# EAGLE design OPL3_adapter (EAGLE 5.11)
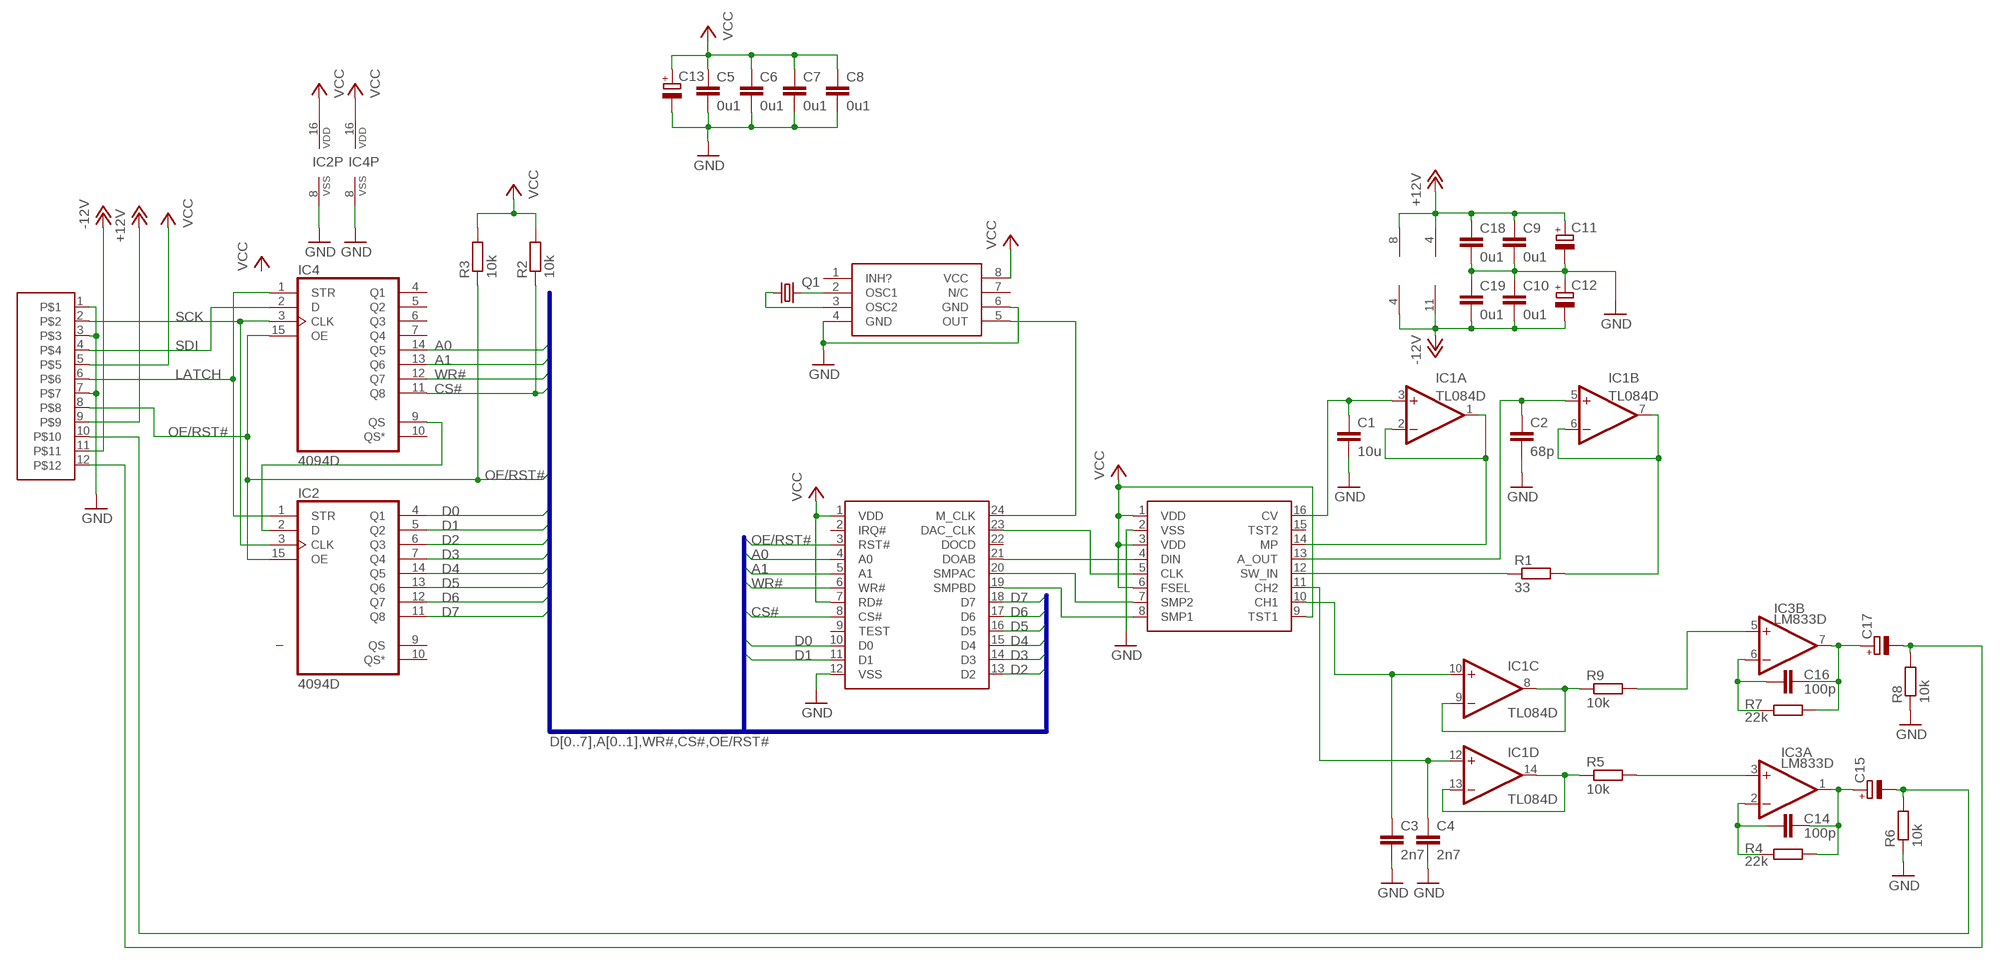
[diagram p0: schematic, sheet 1]

## Parts
C1  10u  C-EUC0805  [C0805]
C2  68p  C-EUC0603  [C0603]
C3  2n7  C-EUC0805  [C0805]
C4  2n7  C-EUC0805  [C0805]
C5  0u1  C-EUC0603  [C0603]
C6  0u1  C-EUC0603  [C0603]
C7  0u1  C-EUC0603  [C0603]
C8  0u1  C-EUC0603  [C0603]
C9  0u1  C-EUC0603  [C0603]
C10  0u1  C-EUC0603  [C0603]
C11  CPOL-EUE2.5-5  [E2,5-5]
C12  CPOL-EUE2.5-5  [E2,5-5]
C13  CPOL-EUE2.5-5  [E2,5-5]
C14  100p  C-EUC0603  [C0603]
C15  CPOL-EUE2.5-5  [E2,5-5]
C16  100p  C-EUC0603  [C0603]
C17  CPOL-EUE2.5-5  [E2,5-5]
C18  0u1  C-EUC0603  [C0603]
C19  0u1  C-EUC0603  [C0603]
IC1  TL084D  [SO14]
IC2  4094D  [SO16]
IC3  LM833D  [SO08]
IC4  4094D  [SO16]
Q1  CRYSTALHC49U-H  [HC49U-H]
R1  33  R-EU_R0603  [R0603]
R2  10k  R-EU_R0402  [R0402]
R3  10k  R-EU_R0402  [R0402]
R4  22k  R-EU_R0603  [R0603]
R5  10k  R-EU_R0603  [R0603]
R6  10k  R-EU_R0603  [R0603]
R7  22k  R-EU_R0603  [R0603]
R8  10k  R-EU_R0603  [R0603]
R9  10k  R-EU_R0603  [R0603]
U$1  YAC512  [16SOP]
U$2  YMF262  [24SOP]
U$3  SMD_PCBEDGE_HDC12  [SMD_PCB_EGGE_HDC12]
U$4  NPC_OSC_IC  [SO-08]

## Nets
+12V: C9.1 C11.+ C18.1 IC1.4(P:V+) IC3.8(P:V+) U$3.9
-12V: C10.2 C12.- C19.2 IC1.11(P:V-) IC3.4(P:V-) U$3.11
A0: IC4.14(Q5) U$2.4(A0)
A1: IC4.13(Q6) U$2.5(A1)
CS#: IC4.11(Q8) R2.1 U$2.8(CS#)
D0: IC2.4(Q1) U$2.10(D0)
D1: IC2.5(Q2) U$2.11(D1)
D2: IC2.6(Q3) U$2.13(D2)
D3: IC2.7(Q4) U$2.14(D3)
D4: IC2.14(Q5) U$2.15(D4)
D5: IC2.13(Q6) U$2.16(D5)
D6: IC2.12(Q7) U$2.17(D6)
D7: IC2.11(Q8) U$2.18(D7)
GND: C1.2 C2.2 C3.2 C4.2 C5.2 C6.2 C7.2 C8.2 C9.2 C10.1 C11.- C12.+ C13.- C18.2 C19.1 IC2.8(VSS) IC4.8(VSS) R6.1 R8.1 U$1.2(VSS) U$2.12(VSS) U$3.1 U$3.3 U$3.7 U$4.4(GND) U$4.6(GND)
LATCH: IC2.1(STR) IC4.1(STR) U$3.6
N$1: IC1.1(A:OUT) IC1.2(A:-IN) U$1.14(MP)
N$2: C1.1 IC1.3(A:+IN) U$1.16(CV)
N$3: R1.1 U$1.12(SW_IN)
N$4: C2.1 IC1.5(B:+IN) U$1.13(A_OUT)
N$5: IC1.6(B:-IN) IC1.7(B:OUT) R1.2
N$6: U$1.5(CLK) U$2.23(DAC_CLK)
N$7: U$1.4(DIN) U$2.21(DOAB)
N$8: IC2.2(D) IC4.9(QS)
N$9: U$1.8(SMP1) U$2.19(SMPBD)
N$10: C17.- R8.2 U$3.12
N$11: IC1.8(C:OUT) IC1.9(C:-IN) R9.1
N$12: C4.1 IC1.12(D:+IN) U$1.11(CH2)
N$13: C3.1 IC1.10(C:+IN) U$1.10(CH1)
N$14: U$1.7(SMP2) U$2.20(SMPAC)
N$16: U$2.24(M_CLK) U$4.5(OUT)
N$17: Q1.2 U$4.2(OSC1)
N$18: Q1.1 U$4.3(OSC2)
N$19: IC3.5(B:+IN) R9.2
N$20: IC1.13(D:-IN) IC1.14(D:OUT) R5.1
N$21: IC3.3(A:+IN) R5.2
N$22: C14.1 IC3.2(A:-IN) R4.1
N$23: C14.2 C15.+ IC3.1(A:OUT) R4.2
N$25: C15.- R6.2 U$3.10
N$27: C16.1 IC3.6(B:-IN) R7.1
N$28: C16.2 C17.+ IC3.7(B:OUT) R7.2
OE/RST#: IC2.15(OE) IC4.15(OE) R3.1 U$2.3(RST#) U$3.8
SCK: IC2.3(CLK) IC4.3(CLK) U$3.2
SDI: IC4.2(D) U$3.4
VCC: C5.1 C6.1 C7.1 C8.1 C13.+ IC2.16(VDD) IC4.16(VDD) R2.2 R3.2 U$1.1(VDD) U$1.3(VDD) U$1.6(FSEL) U$1.9(TST1) U$2.1(VDD) U$2.7(RD#) U$3.5 U$4.8(VCC)
WR#: IC4.12(Q7) U$2.6(WR#)
Unconnected: IC2.9(QS) IC2.10(QS*) IC4.4(Q1) IC4.5(Q2) IC4.6(Q3) IC4.7(Q4) IC4.10(QS*) U$1.15(TST2) U$2.2(IRQ#) U$2.9(TEST) U$2.22(DOCD) U$4.1(INH?) U$4.7(N/C)

## Buses
D[0..7],A[0..1],WR#,CS#,OE/RST#

## Library data of the parts
C1-C10 C14 C16 C18 C19 = rcl:C-EU: CAPACITOR, European symbol
C11-C13 C15 C17 = rcl:CPOL-EU: POLARIZED CAPACITOR, European symbol
IC1 = linear:TL084: OP AMP
IC2 IC4 = 40xx:4094: 8-stage SHIFT/STORE REGISTER, tri-state
IC3 = linear:LM833: OP AMP
Q1 = crystal:CRYSTAL: CRYSTAL; OC_FARNELL: 1666973; OC_NEWARK: unknown
R1-R9 = rcl:R-EU_: RESISTOR, European symbol
U$1 = OPL3:YAC512
U$2 = OPL3:YMF262
U$3 = edgeMounted_HDC:SMD_PCBEDGE_HDC12
U$4 = OSC_IC:NPC_OSC_IC

## Board
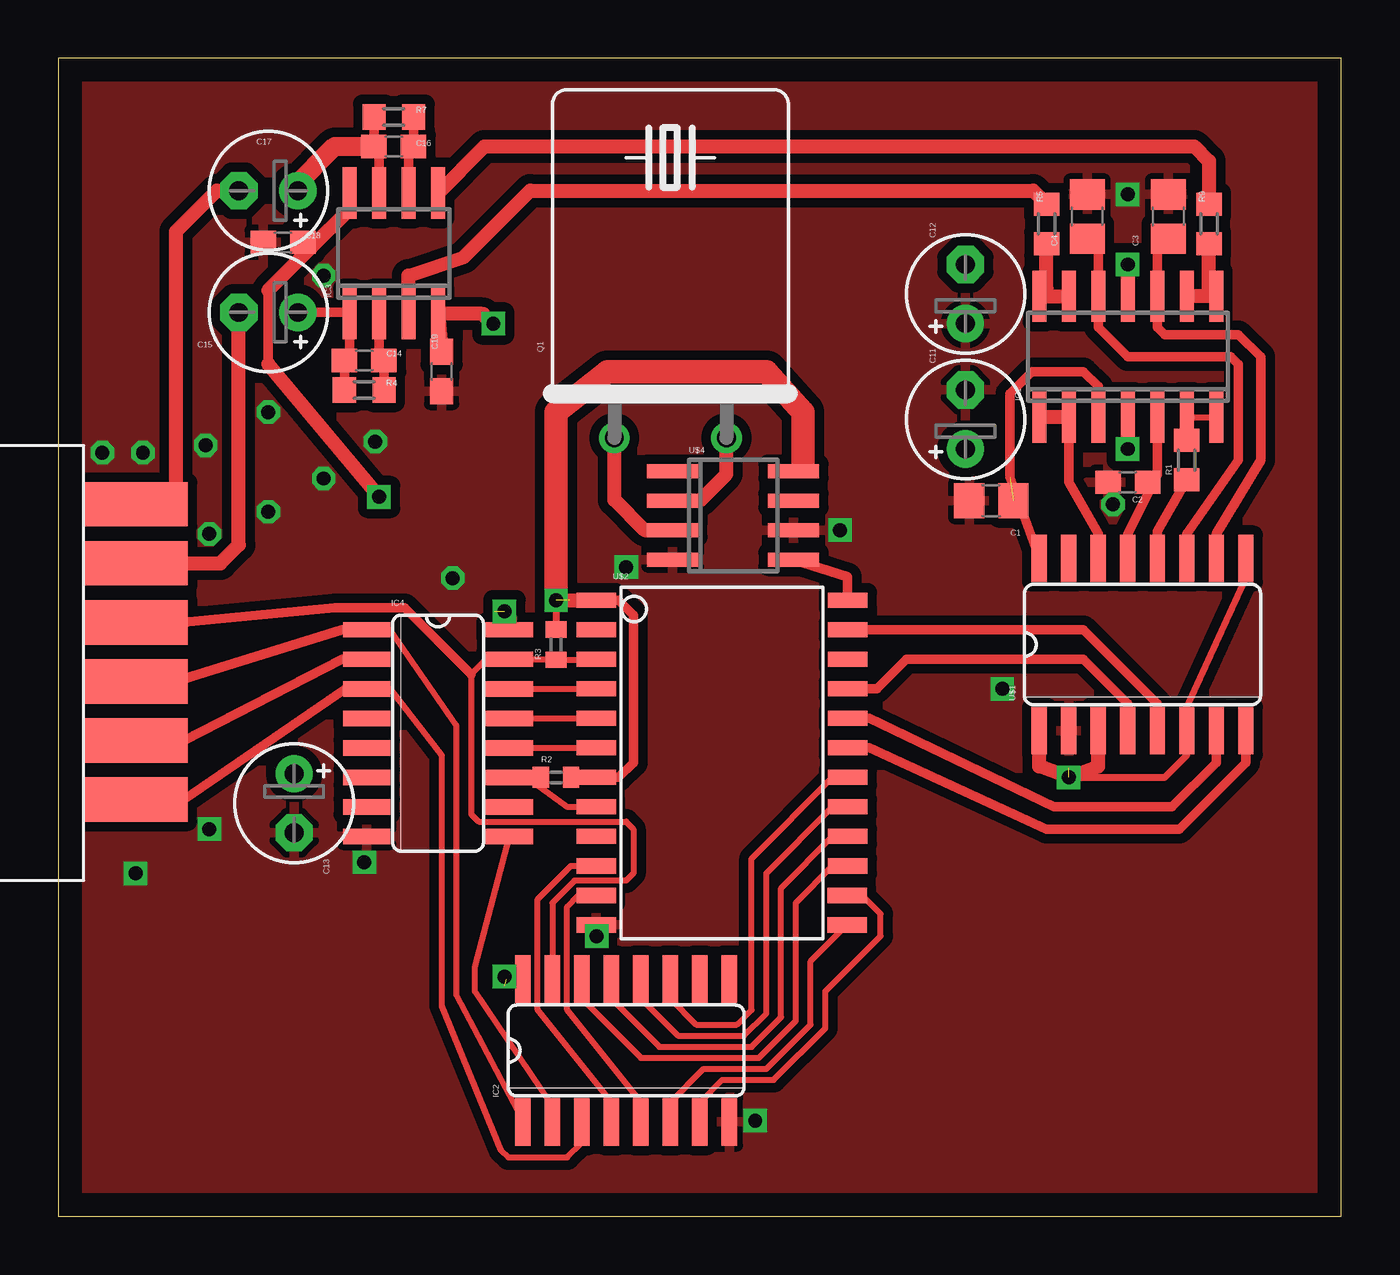
[diagram p1: board, top side]
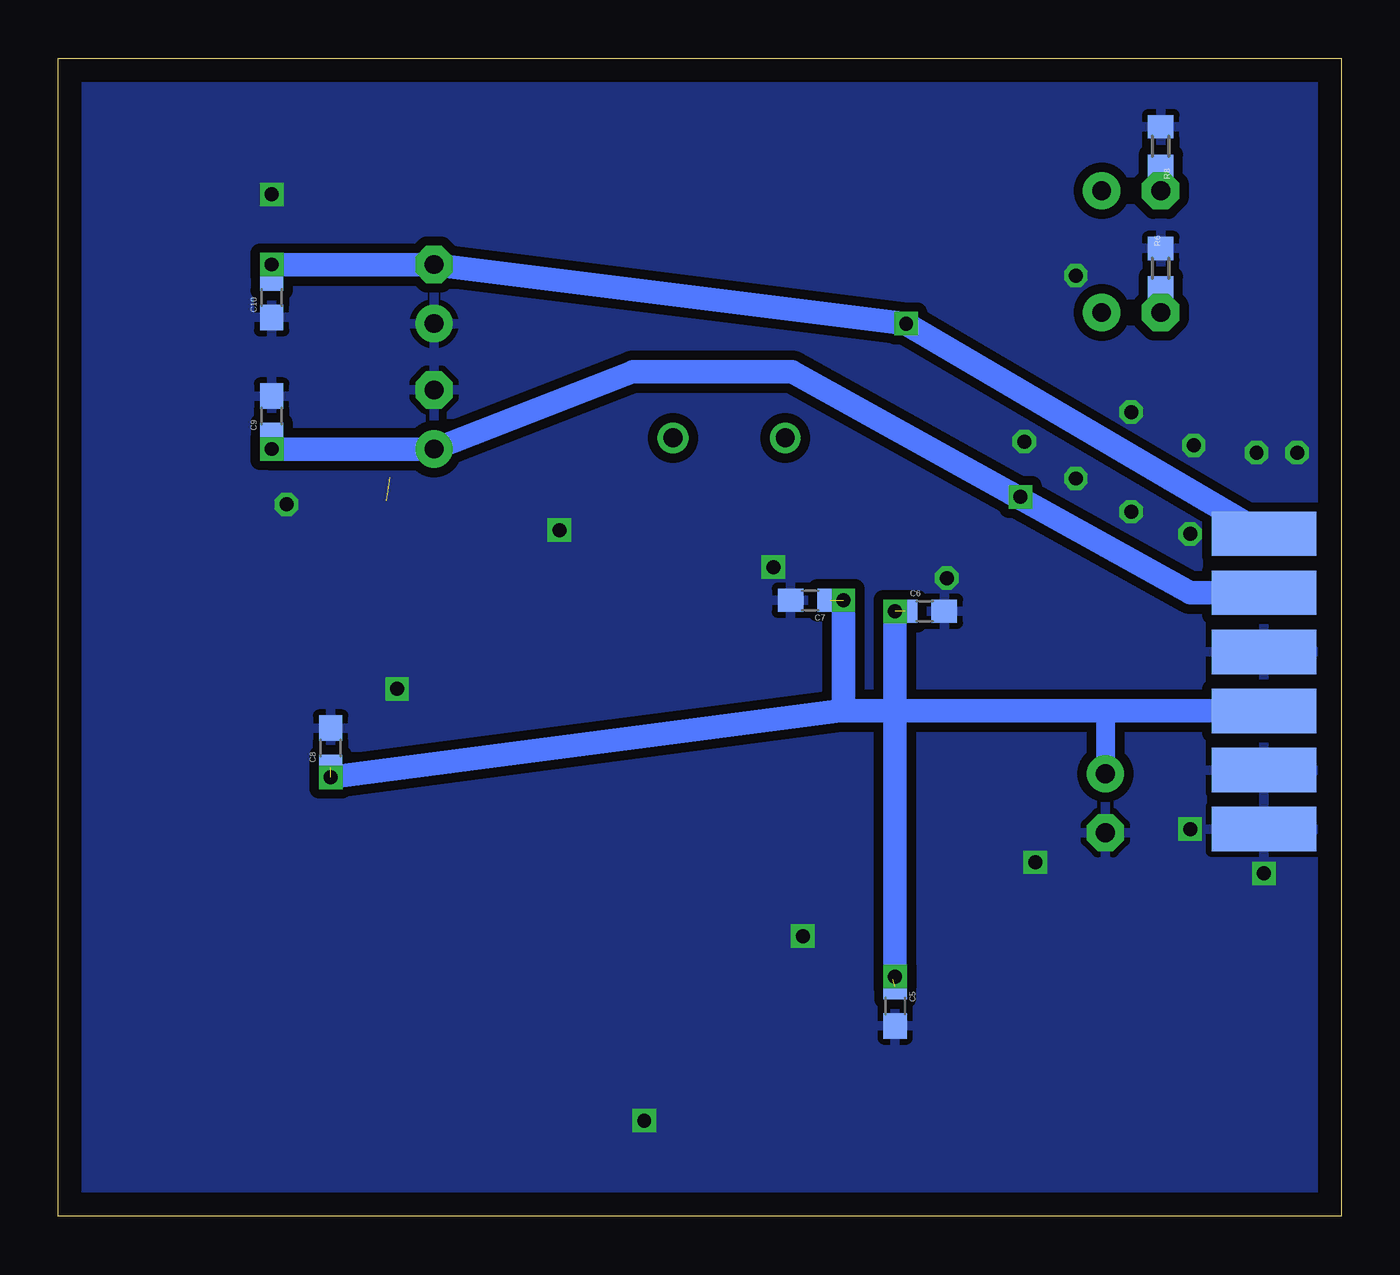
[diagram p2: board, bottom side, seen from below]

Size 55.23 x 49.84 mm. Coordinates in mm from the lower left corner, seen from the top.
Outline: 0,0 55.23,0 55.23,49.84 0,49.84 0,0
Copper layers (1*16): Top 0.035mm / dielectric 1.5mm / Bottom 0.035mm
Design rules "default": minimum track width 10mil, minimum drill 24mil, track to track 8mil, track to pad 8mil, pad to pad 8mil, via to via 8mil, smd to smd 8mil, copper to edge 40mil, drill to drill 8mil, minimum pad ring 10mil, minimum via ring 8mil, stop-mask expansion 4mil, vias tented up to drill 0mil, thermal gap 10mil

### Footprints (pad centres in the part's own frame; a part is rotated, then mirrored left to right if it is on the bottom)
C0805 = smd 1.3 x 1.5: 1 -0.95,0; 2 0.95,0
C0603 = smd 1.1 x 1: 1 -0.85,0; 2 0.85,0
E2,5-5 = drill 0.813 pad 1.6 round: + -1.27,0 | drill 0.813 pad 1.6 octagon: - 1.27,0
SO14 = smd 0.6 x 2.2: 1 -3.81,-2.6; 2 -2.54,-2.6; 3 -1.27,-2.6; 4 0,-2.6; 5 1.27,-2.6; 6 2.54,-2.6; 7 3.81,-2.6; 8 3.81,2.6; 9 2.54,2.6; 10 1.27,2.6; 11 0,2.6; 12 -1.27,2.6; 13 -2.54,2.6; 14 -3.81,2.6
SO16 = smd 0.66 x 2.032: 1 -4.445,-3.073; 2 -3.175,-3.073; 3 -1.905,-3.073; 4 -0.635,-3.073; 5 0.635,-3.073; 6 1.905,-3.073; 7 3.175,-3.073; 8 4.445,-3.073; 9 4.445,3.073; 10 3.175,3.073; 11 1.905,3.073; 12 0.635,3.073; 13 -0.635,3.073; 14 -1.905,3.073; 15 -3.175,3.073; 16 -4.445,3.073
SO08 = smd 0.6 x 2.2: 1 -1.905,-2.6; 2 -0.635,-2.6; 3 0.635,-2.6; 4 1.905,-2.6; 5 1.905,2.6; 6 0.635,2.6; 7 -0.635,2.6; 8 -1.905,2.6
HC49U-H = drill 0.813 round: 1 -2.413,-5.08; 2 2.413,-5.08
R0603 = smd 1 x 1.1: 1 -0.85,0; 2 0.85,0
R0402 = smd 0.7 x 0.9: 1 -0.65,0; 2 0.65,0
16SOP = smd 0.66 x 2.032: 1 -4.445,-3.708; 2 -3.175,-3.708; 3 -1.905,-3.708; 4 -0.635,-3.708; 5 0.635,-3.708; 6 1.905,-3.708; 7 3.175,-3.708; 8 4.445,-3.708; 9 4.445,3.708; 10 3.175,3.708; 11 1.905,3.708; 12 0.635,3.708; 13 -0.635,3.708; 14 -1.905,3.708; 15 -3.175,3.708; 16 -4.445,3.708
24SOP = smd 0.65 x 1.7: 1 -8.89,-4.78; 2 -7.62,-4.78; 3 -6.35,-4.78; 4 -5.08,-4.78; 5 -3.81,-4.78; 6 -2.54,-4.78; 7 -1.27,-4.78; 8 0,-4.78; 9 1.27,-4.78; 10 2.54,-4.78; 11 3.81,-4.78; 12 5.08,-4.78; 13 5.08,6.015; 14 3.81,6.015; 15 2.54,6.05; 16 1.27,6.05; 17 0,6.05; 18 -1.27,6.05; 19 -2.54,6.05; 20 -3.81,6.05; 21 -5.08,6.05; 22 -6.35,6.05; 23 -7.62,6.05; 24 -8.89,6.05
SMD_PCB_EGGE_HDC12 = smd 4.5 x 1.9 bottom: 1 2.54,-7.62; 3 2.54,-5.08; 5 2.54,-2.54; 7 2.54,0; 9 2.54,2.54; 11 2.54,5.08 | smd 4.5 x 1.9: 2 2.54,-6.35; 4 2.54,-3.81; 6 2.54,-1.27; 8 2.54,1.27; 10 2.54,3.81; 12 2.54,6.35
SO-08 = smd 0.6 x 2.2: 1 -1.905,-2.6; 2 -0.635,-2.6; 3 0.635,-2.6; 4 1.905,-2.6; 5 1.905,2.6; 6 0.635,2.6; 7 -0.635,2.6; 8 -1.905,2.6

### Placement (x,y rotation side)
C1  40.16,30.8 180 top
C2  46.04,31.59 180 top
C3  47.78,43.02 90 top
C4  44.29,43.02 90 top
C5  19.21,9.05 270 bottom
C6  17.94,26.04 0 bottom
C7  22.86,26.51 180 bottom
C8  43.5,20.16 90 bottom
C9  46.04,34.45 90 bottom
C10  46.04,39.53 90 bottom
C11  39.05,34.29 90 top
C12  39.05,39.69 90 top
C13  10.16,17.78 270 top
C14  13.18,36.83 180 top
C15  9.05,38.89 180 top
C16  14.45,46.04 180 top
C17  9.05,44.13 180 top
C18  9.68,41.91 180 top
C19  16.51,36.35 90 top
IC1  46.04,36.99 0 top
IC2  24.45,7.14 0 top
IC3  14.45,41.43 0 top
IC4  16.35,20.8 270 top
Q1  26.35,38.58 0 top
R1  48.58,32.54 90 top
R2  21.43,18.89 0 top
R3  21.43,24.61 90 top
R4  13.18,35.56 180 top
R5  42.55,42.7 90 top
R6  7.78,40.8 270 bottom
R7  14.45,47.31 180 top
R8  7.78,46.04 270 bottom
R9  49.53,42.7 90 top
U$1  46.67,24.61 0 top
U$2  27.94,17.62 270 top
U$3  0.79,24.29 0 top
U$4  29.05,30.16 270 top

### Tracks (layer width: path | path; a pad name or v marks a point on that pad's centre or on a via)
+12V  (via drill 0.6 pad 0.25)
  Top 0.406: v46.04,33.02 IC1.4 | 9.05,36.67 9.05,39.85 | C18.1 10.64,41.91 10.87,41.67
  Top 0.61: IC3.8 12.54,43.34 10.87,41.67 9.05,39.85 | v13.81,30.96 9.05,36.67
  Bottom 0.61: v46.04,33.02 C9.1 | v46.04,33.02 | v13.81,30.96 13.81,30.91 14.23,31.12
  Bottom 1.016: U$3.9 6.51,26.83 14.23,31.12 23.65,36.35 30.48,36.35 C11.+ v46.04,33.02
-12V  (via drill 0.6, 0.6 pad 0.25)
  Top 0.61: v46.04,40.96 IC1.11 | 18.26,38.83 IC3.4 C19.2 | 18.26,38.83 18.3,38.83 | v18.73,38.42 18.67,38.42 18.26,38.83
  Bottom 0.61: v46.04,40.96 C10.2
  Bottom 1.016: U$3.11 v18.73,38.42 C12.- | C12.- | C12.- v46.04,40.96
A0
  Top 0.254: IC4.14 U$2.4 | U$2.4
A1
  Top 0.254: IC4.13 U$2.5 | U$2.5
CS#
  Top 0.254: U$2.8 21.91,17.62 20.16,18.89 | 20.16,18.89 R2.1 | IC4.11 20.16,18.89 | 20.16,18.89
D0
  Top 0.254: IC2.4 23.81,4.92 20.64,8.89 20.64,13.65 22.07,15.08 U$2.10
D1
  Top 0.254: IC2.5 25.08,4.92 21.91,8.89 21.91,13.34 22.38,13.81 U$2.11
D2
  Top 0.254: IC2.6 26.35,4.92 27.78,6.35 30.48,6.35 32.38,8.26 32.38,10.97 U$2.13
D3
  Top 0.254: IC2.7 27.62,4.92 28.57,5.87 30.8,5.87 33.02,8.1 33.02,9.68 35.4,12.06 35.4,13.02 34.61,13.81 U$2.14
D4
  Top 0.254: IC2.14 22.54,9.37 25.08,6.83 30.16,6.83 31.75,8.41 31.75,13.49 33.34,15.08 U$2.15
D5
  Top 0.254: IC2.13 23.81,9.37 25.88,7.3 29.84,7.3 31.11,8.57 31.11,14.13 33.34,16.35 U$2.16
D6
  Top 0.254: IC2.12 25.08,9.37 26.67,7.78 29.53,7.78 30.48,8.73 30.48,14.76 33.34,17.62 U$2.17
D7
  Top 0.254: IC2.11 26.35,9.37 27.46,8.26 29.21,8.26 29.84,8.89 29.84,15.4 33.34,18.89 U$2.18
GND  (via drill 0.6)
  other vias: 40.64,22.7 45.4,30.64 13.18,15.24 6.51,16.67 23.18,12.07 3.33,14.76 30,4.13 46.04,43.97 24.45,27.94 6.51,29.37 3.65,32.86 1.91,32.86 6.35,33.18 9.05,34.61 9.05,30.32 11.43,31.75 13.65,33.34 16.99,27.46 11.43,40.48 33.66,29.53
  pour Bottom (isolate 0.406): 0,0 55.56,0 55.56,49.85 0,49.85
  pour Top (isolate 0.406): 0,0 55.56,0 55.56,49.85 0,49.85
LATCH
  Top 0.254: IC2.1 20,4.13 17.14,9.53 17.14,21.11 14.29,25.24 IC4.1 | IC4.1
  Top 0.406: U$3.6 5.08,23.02 12.22,25.24 IC4.1 | IC4.1
N$1
  Top 0.406: U$1.14 44.77,29.37 43.5,31.59 IC1.2
  Top 0.61: IC1.2 IC1.1
N$2  (1 unrouted)
  Top 0.406: U$1.16 40.96,31.81 40.96,35.4 41.91,36.35 44.13,36.35 44.77,35.72 IC1.3
N$3
  Top 0.406: U$1.12 47.31,29.47 R1.1
N$4
  Top 0.254: C2.1 47.05,31.59 47.24,31.78
  Top 0.406: U$1.13 46.04,29.37 47.24,31.78 47.31,31.91 IC1.5
N$5
  Top 0.254: R1.2 IC1.6 IC1.7
N$6
  Top 0.406: U$2.23 44.13,25.24 47.31,22.07 U$1.5
N$7
  Top 0.406: U$2.21 35.24,22.7 36.51,23.97 44.13,23.97 46.04,22.07 U$1.4
N$8
  Top 0.254: IC2.2 21.27,4.76 17.94,9.68 17.94,10.74 IC4.9
N$9
  Top 0.406: U$2.19 34.92,20.16 42.55,16.67 48.26,16.67 51.12,19.53 U$1.8
N$10
  Top 0.61: 5.08,30.64 5.08,35.24 5.08,42.39 6.83,44.13 C17.-
  Top 0.813: U$3.12 5.08,30.64
  Bottom 0.813: C17.- R8.2 | C17.-
N$11
  Top 0.61: IC1.9 IC1.8 49.53,39.91 R9.1
N$12
  Top 0.406: U$1.11 48.58,29.37 50.8,32.54 50.8,36.67 50.48,36.99 46.04,36.99 44.77,38.26 IC1.12 44.77,42.07 C4.1
N$13
  Top 0.406: U$1.10 49.85,29.37 51.75,32.54 51.75,36.99 50.8,37.94 47.62,37.94 47.31,38.26 IC1.10 47.31,42.07 C3.1
N$14
  Top 0.406: U$2.20 34.92,21.43 42.86,17.62 47.94,17.62 49.85,19.53 U$1.7
N$16
  Top 0.406: U$2.24 33.97,26.51 33.97,27.52 U$4.5
N$17
  Top 0.61: Q1.2 28.77,31.94 27.62,30.8 U$4.2
N$18
  Top 0.61: Q1.1 23.94,30.83 25.24,29.53 U$4.3
N$19
  Top 0.61: R9.2 49.53,45.4 48.9,46.04 18.36,46.04 IC3.5
N$20
  Top 0.61: IC1.13 IC1.14 42.55,39.91 R5.1
N$21
  Top 0.61: IC3.3 15.08,40.48 17.46,41.27 20.32,44.13 41.97,44.13 R5.2
N$22
  Top 0.406: IC3.2 13.81,37.05 C14.1 R4.1
N$23
  Top 0.406: R4.2 C14.2 12.54,37.05 IC3.1 12.48,38.89 C15.+
N$25
  Top 0.61: U$3.10 6.99,28.1 7.78,28.89 C15.-
  Bottom 0.813: C15.- R6.2 | C15.-
N$27
  Top 0.406: R7.1 C16.1 15.08,45.82 IC3.6
N$28
  Top 0.406: R7.2 C16.2 13.81,45.82 IC3.7
  Top 0.813: C17.+ 10.16,44.29 11.91,46.04 C16.2 | C16.2
OE/RST#
  Top 0.254: IC4.15 21.42,23.97 R3.1 23.14,23.96 U$2.3 | IC2.15 21.27,13.49 22.23,14.45 24.45,14.45 24.77,14.76 24.77,16.67 24.45,16.99 18.1,16.99 17.78,17.3 17.78,23.34 18.41,23.97 IC4.15 | IC4.15
  Top 0.406: R3.1 21.13,23.97 | 17.78,23.34 14.92,26.19 11.91,26.19 5.4,25.56 U$3.8
SCK
  Top 0.254: IC2.3 22.54,3.17 21.91,2.54 19.37,2.54 19.05,2.86 16.51,9.05 16.51,19.84 14.29,22.7 IC4.3 | IC4.3
  Top 0.406: U$3.2 5.4,17.94 12.38,22.7 IC4.3 | IC4.3
SDI
  Top 0.406: U$3.4 5.4,20.48 12.22,23.97 IC4.2 | IC4.2
VCC  (via drill 0.6)  (4 unrouted)
  Top 0.305: R3.2 21.43,26.35 v21.43,26.51 | U$2.7 R2.2 | v43.5,18.89 47.62,18.89 48.58,19.84 U$1.6 48.58,21.91 51.12,27.46 U$1.9
  Top 0.406: U$2.7 24.13,18.89 24.77,19.53 24.77,25.88 24.13,26.51 U$2.1
  Top 0.61: U$1.1 42.23,19.37 v43.5,18.89 | v43.5,18.89 44.77,19.37 U$1.3 | v21.43,26.51 U$2.1 | v43.5,18.89 | IC2.16 19.31,10.22 v19.21,10.32 | IC4.16 19.43,25.82 v19.21,26.04 | 32.07,32.38 32.07,32.07 | 32.07,32.07 32.38,32.07 | 32.07,32.07 U$4.8
  Top 0.813: v21.43,26.51
  Top 1.016: v21.43,26.51 21.43,34.61 23.65,36.35 30.48,36.35 32.07,34.61 32.07,32.38
  Bottom 0.813: C13.+ 10.16,21.59 10.32,21.75
  Bottom 1.016: U$3.5 10.32,21.75 19.21,21.75 | 19.21,21.75 21.43,21.75 | 19.21,21.75 v19.21,10.32 | 19.21,21.75 v19.21,26.04 | 21.43,21.75 v21.43,26.51 | 21.43,21.75 21.59,21.75 v43.5,18.89
WR#
  Top 0.254: IC4.12 U$2.6 | U$2.6